# Altium project HLib-MBoard1.PrjPCB
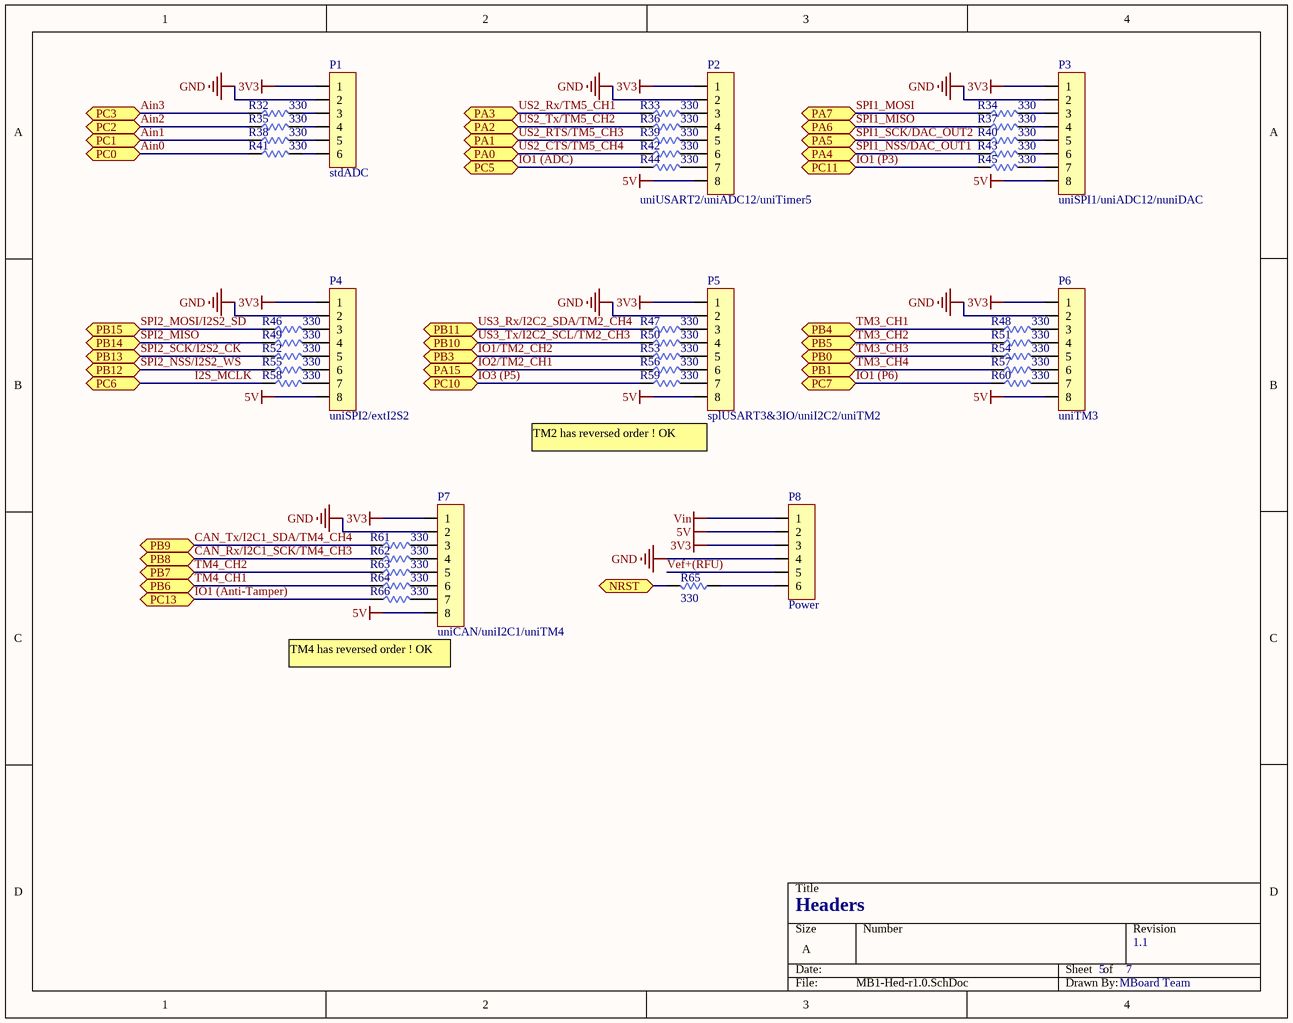
[diagram p0: MB1-Hed-r1.0.SchDoc]
6 sheets, 134 parts. Net scope: hierarchical (ports join the sheet entries above them; power ports are global).
Board file: HLib-MBoard1.PcbDoc
Sheets:
  MB1-Hed-r1.0.SchDoc
  MB1-MCU-r1.0.SchDoc
  MB1-USB-r1.0.SchDoc
  MB1-SD_CARD.SchDoc
  MB1-LED_BUTTON.SchDoc
  MB1-Pwr-r1.0.SchDoc

## Sheet MB1-Hed-r1.0.SchDoc: Headers
size A; DrawnBy: MBoard Team; DocumentNumber: 5; Revision: 1.1; SheetNumber: 5; SheetTotal: 7

### Parts
P1  stdADC  [Hed6]
P2  uniUSART2/uniADC12/uniTimer5  [Hed8]
P3  uniSPI1/uniADC12/nuniDAC  [Hed8]
P4  uniSPI2/extI2S2  [Hed8]
P5  splUSART3&3IO/uniI2C2/uniTM2  [Hed8]
P6  uniTM3  [Hed8]
P7  uniCAN/uniI2C1/uniTM4  [Hed8]
P8  Power  [Hed6]
R32  value 330  [SM_0805_R]  (hidden comment: R)
R33  value 330  [SM_0805_R]  (hidden comment: R)
R34  value 330  [SM_0805_R]  (hidden comment: R)
R35  value 330  [SM_0805_R]  (hidden comment: R)
R36  value 330  [SM_0805_R]  (hidden comment: R)
R37  value 330  [SM_0805_R]  (hidden comment: R)
R38  value 330  [SM_0805_R]  (hidden comment: R)
R39  value 330  [SM_0805_R]  (hidden comment: R)
R40  value 330  [SM_0805_R]  (hidden comment: R)
R41  value 330  [SM_0805_R]  (hidden comment: R)
R42  value 330  [SM_0805_R]  (hidden comment: R)
R43  value 330  [SM_0805_R]  (hidden comment: R)
R44  value 330  [SM_0805_R]  (hidden comment: R)
R45  value 330  [SM_0805_R]  (hidden comment: R)
R46  value 330  [SM_0805_R]  (hidden comment: R)
R47  value 330  [SM_0805_R]  (hidden comment: R)
R48  value 330  [SM_0805_R]  (hidden comment: R)
R49  value 330  [SM_0805_R]  (hidden comment: R)
R50  value 330  [SM_0805_R]  (hidden comment: R)
R51  value 330  [SM_0805_R]  (hidden comment: R)
R52  value 330  [SM_0805_R]  (hidden comment: R)
R53  value 330  [SM_0805_R]  (hidden comment: R)
R54  value 330  [SM_0805_R]  (hidden comment: R)
R55  value 330  [SM_0805_R]  (hidden comment: R)
R56  value 330  [SM_0805_R]  (hidden comment: R)
R57  value 330  [SM_0805_R]  (hidden comment: R)
R58  value 330  [SM_0805_R]  (hidden comment: R)
R59  value 330  [SM_0805_R]  (hidden comment: R)
R60  value 330  [SM_0805_R]  (hidden comment: R)
R61  value 330  [SM_0805_R]  (hidden comment: R)
R62  value 330  [SM_0805_R]  (hidden comment: R)
R63  value 330  [SM_0805_R]  (hidden comment: R)
R64  value 330  [SM_0805_R]  (hidden comment: R)
R65  value 330  [SM_0805_R]  (hidden comment: R)
R66  value 330  [SM_0805_R]  (hidden comment: R)

### Ports
NRST (bidir), PA0 (bidir), PA1 (bidir), PA2 (bidir), PA3 (bidir), PA4 (bidir), PA5 (bidir), PA6 (bidir), PA7 (bidir), PA15 (bidir), PB0 (bidir), PB1 (bidir), PB3 (bidir), PB4 (bidir), PB5 (bidir), PB6 (bidir), PB7 (bidir), PB8 (bidir), PB9 (bidir), PB10 (bidir), PB11 (bidir), PB12 (bidir), PB13 (bidir), PB14 (bidir), PB15 (bidir), PC0 (bidir), PC1 (bidir), PC2 (bidir), PC3 (bidir), PC5 (bidir), PC6 (bidir), PC7 (bidir), PC10 (bidir), PC11 (bidir), PC13 (bidir)

### Nets
3V3: P1.1 P2.1 P3.1 P4.1 P5.1 P6.1 P7.1 P8.3
5V: P2.8 P3.8 P4.8 P5.8 P6.8 P7.8 P8.2
GND: P1.2 P2.2 P3.2 P4.2 P5.2 P6.2 P7.2 P8.4
Vin: P8.1
Ain0: R41.1 ; port PC0
Ain1: R38.1 ; port PC1
Ain2: R35.1 ; port PC2
Ain3: R32.1 ; port PC3
CAN_Rx/I2C1_SCK/TM4_CH3: R62.1 ; port PB8
CAN_Tx/I2C1_SDA/TM4_CH4: R61.1 ; port PB9
I2S_MCLK: R58.1 ; port PC6
IO1 (ADC): R44.1 ; port PC5
IO1 (Anti-Tamper): R66.1 ; port PC13
IO1 (P3): R45.1 ; port PC11
IO1 (P6): R60.1 ; port PC7
IO1/TM2_CH2: R53.1 ; port PB3
IO2/TM2_CH1: R56.1 ; port PA15
IO3 (P5): R59.1 ; port PC10
SPI1_MISO: R37.1 ; port PA6
SPI1_MOSI: R34.1 ; port PA7
SPI1_NSS/DAC_OUT1: R43.1 ; port PA4
SPI1_SCK/DAC_OUT2: R40.1 ; port PA5
SPI2_MISO: R49.1 ; port PB14
SPI2_MOSI/I2S2_SD: R46.1 ; port PB15
SPI2_NSS/I2S2_WS: R55.1 ; port PB12
SPI2_SCK/I2S2_CK: R52.1 ; port PB13
TM3_CH1: R48.1 ; port PB4
TM3_CH2: R51.1 ; port PB5
TM3_CH3: R54.1 ; port PB0
TM3_CH4: R57.1 ; port PB1
TM4_CH1: R64.1 ; port PB6
TM4_CH2: R63.1 ; port PB7
US2_CTS/TM5_CH4: R42.1 ; port PA0
US2_RTS/TM5_CH3: R39.1 ; port PA1
US2_Rx/TM5_CH1: R33.1 ; port PA3
US2_Tx/TM5_CH2: R36.1 ; port PA2
US3_Rx/I2C2_SDA/TM2_CH4: R47.1 ; port PB11
US3_Tx/I2C2_SCL/TM2_CH3: R50.1 ; port PB10
Vef+(RFU): P8.5
NetP1_3: P1.3 R32.2
NetP1_4: P1.4 R35.2
NetP1_5: P1.5 R38.2
NetP1_6: P1.6 R41.2
NetP2_3: P2.3 R33.2
NetP2_4: P2.4 R36.2
NetP2_5: P2.5 R39.2
NetP2_6: P2.6 R42.2
NetP2_7: P2.7 R44.2
NetP3_3: P3.3 R34.2
NetP3_4: P3.4 R37.2
NetP3_5: P3.5 R40.2
NetP3_6: P3.6 R43.2
NetP3_7: P3.7 R45.2
NetP4_3: P4.3 R46.2
NetP4_4: P4.4 R49.2
NetP4_5: P4.5 R52.2
NetP4_6: P4.6 R55.2
NetP4_7: P4.7 R58.2
NetP5_3: P5.3 R47.2
NetP5_4: P5.4 R50.2
NetP5_5: P5.5 R53.2
NetP5_6: P5.6 R56.2
NetP5_7: P5.7 R59.2
NetP6_3: P6.3 R48.2
NetP6_4: P6.4 R51.2
NetP6_5: P6.5 R54.2
NetP6_6: P6.6 R57.2
NetP6_7: P6.7 R60.2
NetP7_3: P7.3 R61.2
NetP7_4: P7.4 R62.2
NetP7_5: P7.5 R63.2
NetP7_6: P7.6 R64.2
NetP7_7: P7.7 R66.2
NetP8_6: P8.6 R65.2
NetR65_1: R65.1 ; port NRST

### Notes on the sheet
- TM2 has reversed order ! OK
- TM4 has reversed order ! OK

### Library data of the parts
P1 P8 = Hed6
P2-P7 = Hed8
R32-R66 = R: Resistor; Published: 8-Jun-2000; LatestRevisionDate: 29-May-2009; LatestRevisionNote: IPC-7351 Footprint Added.; PackageReference: J1-0603; Publisher: Altium Limited; PackageDescription: Chip Resistor

## Sheet MB1-MCU-r1.0.SchDoc: STM32F103
size A; DrawnBy: MBoard team; DocumentNumber: 2; Revision: 1.1; SheetNumber: 2; SheetTotal: 7
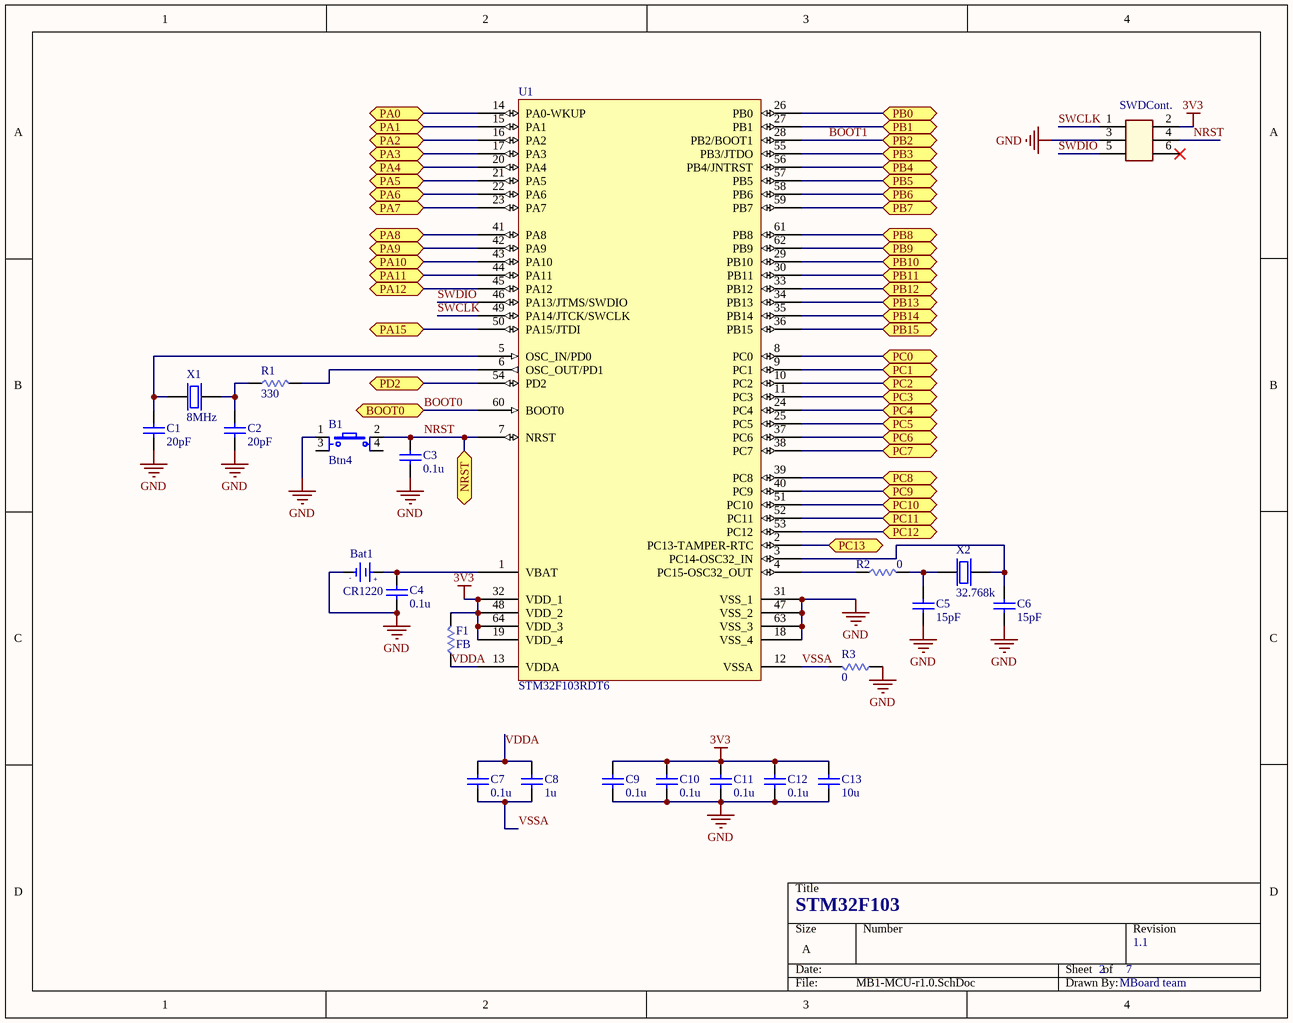
[diagram p1: MB1-MCU-r1.0.SchDoc]

### Parts
B1  Btn4  [Horizon_SW_4pin_rectangular]
Bat1  value CR1220  [PIN3VSOCKET-SMD]  (hidden comment: PIN 3V)
C1  value 20pF  [SM_0805_C_CERAMIC]  (hidden comment: CAP Ceramic)
C2  value 20pF  [SM_0805_C_CERAMIC]  (hidden comment: CAP Ceramic)
C3  value 0.1u  [SM_0805_C_CERAMIC]  (hidden comment: CAP Ceramic)
C4  value 0.1u  [SM_0805_C_CERAMIC]  (hidden comment: CAP Ceramic)
C5  value 15pF  [SM_0805_C_CERAMIC]  (hidden comment: CAP Ceramic)
C6  value 15pF  [SM_0805_C_CERAMIC]  (hidden comment: CAP Ceramic)
C7  value 0.1u  [SM_0805_C_CERAMIC]  (hidden comment: CAP Ceramic)
C8  value 1u  [SM_0805_C_CERAMIC]  (hidden comment: CAP Ceramic)
C9  value 0.1u  [SM_0805_C_CERAMIC]  (hidden comment: CAP Ceramic)
C10  value 0.1u  [SM_0805_C_CERAMIC]  (hidden comment: CAP Ceramic)
C11  value 0.1u  [SM_0805_C_CERAMIC]  (hidden comment: CAP Ceramic)
C12  value 0.1u  [SM_0805_C_CERAMIC]  (hidden comment: CAP Ceramic)
C13  value 10u  [SM_0805_C_CERAMIC]  (hidden comment: CAP Ceramic)
F1  value FB  [SM_0805_R]  (hidden comment: Ferrite bead)
R1  value 330  [SM_0805_R]
R2  value 0  [SM_0805_R]
R3  value 0  [SM_0805_R]
SWDCont.  SWD  [Hed3x2-RA]  (value not drawn)
U1  STM32F103RDT6  [LQFP64_L]
X1  value 8MHz  [HC49/US-SMD]  (hidden comment: Crystal 2 pin.)
X2  value 32.768k  [XT32-LOB]  (hidden comment: Crystal 32.768 k)

### Ports
BOOT0 (bidir), NRST (bidir), PA0 (bidir), PA1 (bidir), PA2 (bidir), PA3 (bidir), PA4 (bidir), PA5 (bidir), PA6 (bidir), PA7 (bidir), PA8 (bidir), PA9 (bidir), PA10 (bidir), PA11 (bidir), PA12 (bidir), PA15 (bidir), PB0 (bidir), PB1 (bidir), PB2 (bidir), PB3 (bidir), PB4 (bidir), PB5 (bidir), PB6 (bidir), PB7 (bidir), PB8 (bidir), PB9 (bidir), PB10 (bidir), PB11 (bidir), PB12 (bidir), PB13 (bidir), PB14 (bidir), PB15 (bidir), PC0 (bidir), PC1 (bidir), PC2 (bidir), PC3 (bidir), PC4 (bidir), PC5 (bidir), PC6 (bidir), PC7 (bidir), PC8 (bidir), PC9 (bidir), PC10 (bidir), PC11 (bidir), PC12 (bidir), PC13 (bidir), PD2 (bidir)

### Nets
3V3: C9.2 C10.2 C11.2 C12.2 C13.2 F1.2 SWDCont..2 U1.19(VDD_4) U1.32(VDD_1) U1.48(VDD_2) U1.64(VDD_3)
GND: B1.1(Tab) Bat1.2(GND) C1.1 C2.1 C3.1 C4.1 C5.1 C6.1 C9.1 C10.1 C11.1 C12.1 C13.1 R3.1 SWDCont..3 U1.18(VSS_4) U1.31(VSS_1) U1.47(VSS_2) U1.63(VSS_3)
BOOT0: U1.60(BOOT0) ; port BOOT0
BOOT1: U1.28(PB2/BOOT1) ; port PB2
NRST: B1.2(Tab) C3.2 SWDCont..4 U1.7(NRST) ; port NRST
SWCLK: SWDCont..1 U1.49(PA14/JTCK/SWCLK)
SWDIO: SWDCont..5 U1.46(PA13/JTMS/SWDIO)
VDDA: C7.2 C8.2 F1.1 U1.13(VDDA)
VSSA: C7.1 C8.1 R3.2 U1.12(VSSA)
NetBat1_1: Bat1.1(+3V) C4.2 U1.1(VBAT)
NetC1_2: C1.2 U1.5(OSC_IN/PD0) X1.1(Xin)
NetC2_2: C2.2 R1.1 X1.2(Xout)
NetC5_2: C5.2 R2.2 X2.1(Xin)
NetC6_2: C6.2 U1.3(PC14-OSC32_IN) X2.2(Xout)
NetR1_2: R1.2 U1.6(OSC_OUT/PD1)
NetR2_1: R2.1 U1.4(PC15-OSC32_OUT)
NetU1_2: U1.2(PC13-TAMPER-RTC) ; port PC13
NetU1_8: U1.8(PC0) ; port PC0
NetU1_9: U1.9(PC1) ; port PC1
NetU1_10: U1.10(PC2) ; port PC2
NetU1_11: U1.11(PC3) ; port PC3
NetU1_14: U1.14(PA0-WKUP) ; port PA0
NetU1_15: U1.15(PA1) ; port PA1
NetU1_16: U1.16(PA2) ; port PA2
NetU1_17: U1.17(PA3) ; port PA3
NetU1_20: U1.20(PA4) ; port PA4
NetU1_21: U1.21(PA5) ; port PA5
NetU1_22: U1.22(PA6) ; port PA6
NetU1_23: U1.23(PA7) ; port PA7
NetU1_24: U1.24(PC4) ; port PC4
NetU1_25: U1.25(PC5) ; port PC5
NetU1_26: U1.26(PB0) ; port PB0
NetU1_27: U1.27(PB1) ; port PB1
NetU1_29: U1.29(PB10) ; port PB10
NetU1_30: U1.30(PB11) ; port PB11
NetU1_33: U1.33(PB12) ; port PB12
NetU1_34: U1.34(PB13) ; port PB13
NetU1_35: U1.35(PB14) ; port PB14
NetU1_36: U1.36(PB15) ; port PB15
NetU1_37: U1.37(PC6) ; port PC6
NetU1_38: U1.38(PC7) ; port PC7
NetU1_39: U1.39(PC8) ; port PC8
NetU1_40: U1.40(PC9) ; port PC9
NetU1_41: U1.41(PA8) ; port PA8
NetU1_42: U1.42(PA9) ; port PA9
NetU1_43: U1.43(PA10) ; port PA10
NetU1_44: U1.44(PA11) ; port PA11
NetU1_45: U1.45(PA12) ; port PA12
NetU1_50: U1.50(PA15/JTDI) ; port PA15
NetU1_51: U1.51(PC10) ; port PC10
NetU1_52: U1.52(PC11) ; port PC11
NetU1_53: U1.53(PC12) ; port PC12
NetU1_54: U1.54(PD2) ; port PD2
NetU1_55: U1.55(PB3/JTDO) ; port PB3
NetU1_56: U1.56(PB4/JNTRST) ; port PB4
NetU1_57: U1.57(PB5) ; port PB5
NetU1_58: U1.58(PB6) ; port PB6
NetU1_59: U1.59(PB7) ; port PB7
NetU1_61: U1.61(PB8) ; port PB8
NetU1_62: U1.62(PB9) ; port PB9

Not connected (* = marked no-connect by the designer): B1 3(Tab) 4(Tab); SWDCont. 6*

### Notes on the sheet
- (in symbol PIN 3V) -; +

### Library data of the parts
Bat1 = PIN 3V: Battery 3VDC
C1-C13 = CAP Ceramic: Non-polarity ceramic capacitor; Published: 8-Jun-2000; LatestRevisionDate: 17-Jul-2002; LatestRevisionNote: Re-released for DXP Platform.; PackageReference: RAD-0.3; Publisher: Altium Limited; PackageDescription: Radial Cap, Thru-Hole; 2 Leads; 0.3 in Pin Spacing
F1 R1-R3 = R: Resistor; Published: 8-Jun-2000; LatestRevisionDate: 29-May-2009; LatestRevisionNote: IPC-7351 Footprint Added.; PackageReference: J1-0603; Publisher: Altium Limited; PackageDescription: Chip Resistor
SWDCont. = HD_3x2: Header, 3-pins/row, double row,
U1 = STM32F103RBT6: STM32 ARM-based 32-bit MCU with 128 Kbytes Flash, 64-pin LQFP, Industrial Temperature; Published: 30-May-2008; DatasheetVersion: rev6, Mar-2008; PackageVersion: Mar-2008; PackageReference: LQFP64; Publisher: Altium Limited; PackageDescription: 64-Pin Low-Profile Quad Flat Pack, 10 x 10 mm Body, 0.5 mm Pitch (LQFP64); ComponentLink1Description: Manufacturer Link; ComponentLink1URL: www.st.com/stm32; ComponentLink2Description: Datasheet; ComponentLink2URL: http://www.st.com/stonline/products/literature/ds/13587.pdf
X1 = XT2
X2 = XT32k

## Sheet MB1-USB-r1.0.SchDoc: USB2Com & USB Native
size A; DrawnBy: MBoard team; DocumentNumber: 3; Revision: 1.1; SheetNumber: 3; SheetTotal: 7
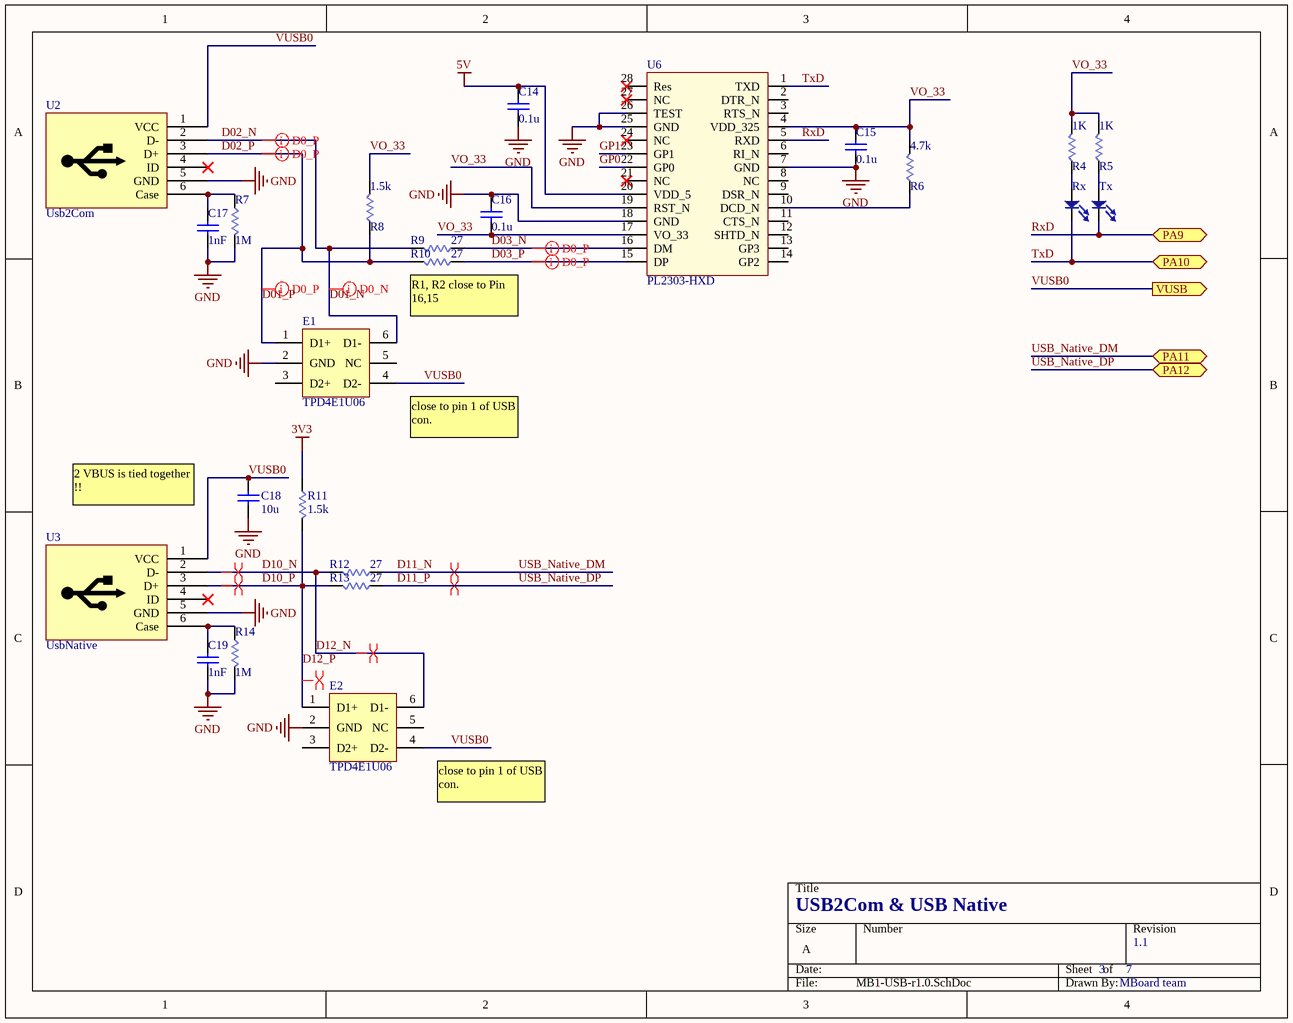
[diagram p2: MB1-USB-r1.0.SchDoc]

### Parts
C14  value 0.1u  [SM_0805_C_CERAMIC]  (hidden comment: CAP Ceramic)
C15  value 0.1u  [SM_0805_C_CERAMIC]  (hidden comment: CAP Ceramic)
C16  value 0.1u  [SM_0805_C_CERAMIC]  (hidden comment: CAP Ceramic)
C17  value 1nF  [SM_0805_C_CERAMIC]  (hidden comment: CAP Ceramic)
C18  value 10u  [SM_0805_C_CERAMIC]  (hidden comment: CAP Ceramic)
C19  value 1nF  [SM_0805_C_CERAMIC]  (hidden comment: CAP Ceramic)
E1  TPD4E1U06  [SC70-6]
E2  TPD4E1U06  [SC70-6]
R4  value 1K  [SM_0805_R]
R5  value 1K  [SM_0805_R]
R6  value 4.7k  [SM_0805_R]
R7  value 1M  [SM_0805_R]
R8  value 1.5k  [SM_0805_R]
R9  value 27  [SM_0805_R]
R10  value 27  [SM_0805_R]
R11  value 1.5k  [SM_0805_R]
R12  value 27  [SM_0805_R]
R13  value 27  [SM_0805_R]
R14  value 1M  [SM_0805_R]
Rx  Blue  [SM_0805_POL_LD]  (value not drawn)
Tx  Green  [SM_0805_POL_LD]  (value not drawn)
U2  Usb2Com  [USB_Micro_typeB_2]
U3  UsbNative  [USB_Micro_typeB_2]
U6  PL2303-HXD  [SSOP-28]

### Ports
PA9 (bidir), PA10 (bidir), PA11 (bidir), PA12 (bidir), VUSB (out)

### Nets
3V3: R11.1
5V: C14.2 U6.20(VDD_5)
GND: C14.1 C15.1 C16.2 C17.1 C18.1 C19.1 E1.2(GND) E2.2(GND) R7.2 R14.2 U2.5(GND) U3.5(GND) U6.7(GND) U6.18(GND) U6.25(GND) U6.26(TEST)
D01_N: E1.6(D1-) R9.2 U2.2(D-)  [also labelled D02_N]
D01_P: E1.1(D1+) R8.1 R10.2 U2.3(D+)  [also labelled D02_P]
D03_N: R9.1 U6.16(DM)
D03_P: R10.1 U6.15(DP)
D10_N: E2.6(D1-) R12.2 U3.2(D-)  [also labelled D12_N]
D10_P: E2.1(D1+) R11.2 R13.2 U3.3(D+)  [also labelled D12_P]
D11_N: R12.1 ; port PA11  [also labelled USB_Native_DM]
D11_P: R13.1 ; port PA12  [also labelled USB_Native_DP]
GP0: U6.22(GP0)
GP1: U6.23(GP1)
RxD: Tx.2(K) U6.5(RXD) ; port PA9
TxD: Rx.2(K) U6.1(TXD) ; port PA10
VO_33: C15.2 C16.1 R4.2 R5.2 R6.2 R8.2 U6.4(VDD_325) U6.17(VO_33) U6.19(RST_N)
VUSB0: C18.2 E1.4(D2-) E2.4(D2-) U2.1(VCC) U3.1(VCC) ; port VUSB
NetC17_2: C17.2 R7.1 U2.6(Case)
NetC19_2: C19.2 R14.1 U3.6(Case)
NetR4_1: R4.1 Rx.1(A)
NetR5_1: R5.1 Tx.1(A)
NetR6_1: R6.1 U6.10(DCD_N)

Not connected (* = marked no-connect by the designer): E1 3(D2+) 5(NC); E2 3(D2+) 5(NC); U2 4(ID)*; U3 4(ID)*; U6 2(DTR_N) 3(RTS_N) 6(RI_N) 8(NC) 9(DSR_N) 11(CTS_N) 12(SHTD_N) 13(GP3) 14(GP2) 21(NC)* 24(NC)* 27(NC)* 28(Res)*

### Layout directives
differential pair: D01_N, D01_P, D03_N, D03_P, D10_N, D10_P, D11_N, D11_P

### Notes on the sheet
- (near R10) R1, R2 close to Pin 16,15
- (near E1) close to pin 1 of USB con.
- 2 VBUS is tied together !!
- (near E2) close to pin 1 of USB con.

### Library data of the parts
C14-C19 = CAP Ceramic: Non-polarity ceramic capacitor; Published: 8-Jun-2000; LatestRevisionDate: 17-Jul-2002; LatestRevisionNote: Re-released for DXP Platform.; PackageReference: RAD-0.3; Publisher: Altium Limited; PackageDescription: Radial Cap, Thru-Hole; 2 Leads; 0.3 in Pin Spacing
R4-R14 = R: Resistor; Published: 8-Jun-2000; LatestRevisionDate: 29-May-2009; LatestRevisionNote: IPC-7351 Footprint Added.; PackageReference: J1-0603; Publisher: Altium Limited; PackageDescription: Chip Resistor
Rx Tx = LED: Published: 8-Jun-2000; LatestRevisionDate: 08-Jul-2005; LatestRevisionNote: Mech Layer 1 removed.; PackageReference: LED-1; Publisher: Altium Limited; PackageDescription: LED; 2 Leads
U2 U3 = USB-Mini-B

## Sheet MB1-SD_CARD.SchDoc: uSD card
size A; Author: Nguyen Van Hien; DrawnBy: MBoard team; DocumentNumber: 6; Revision: 1.1; SheetNumber: 6; SheetTotal: 7; DocumentName: SD_CARD
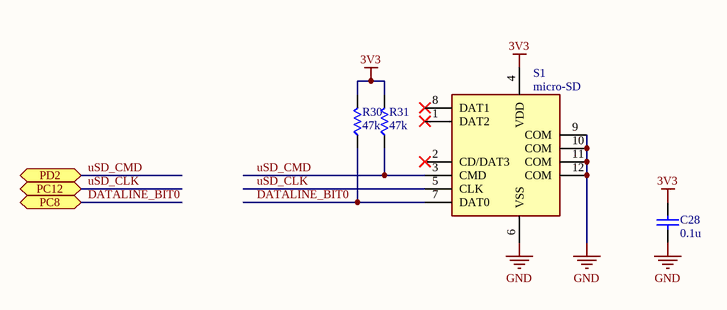
[diagram p3: MB1-SD_CARD.SchDoc]

### Parts
C28  value 0.1u  [SM_0805_C_CERAMIC]  (hidden comment: CAP_Ceramic)
R30  value 47k  [SM_0805_R]
R31  value 47k  [SM_0805_R]
S1  micro-SD  [micro-SD]

### Ports
PC8 (bidir), PC12 (bidir), PD2 (bidir)

### Nets
3V3: C28.2 R30.2 R31.2 S1.4(VDD)
GND: C28.1 S1.6(VSS) S1.9(COM) S1.10(COM) S1.11(COM) S1.12(COM)
DATALINE_BIT0: R30.1 S1.7(DAT0) ; port PC8
uSD_CLK: S1.5(CLK) ; port PC12
uSD_CMD: R31.1 S1.3(CMD) ; port PD2

Not connected (* = marked no-connect by the designer): S1 1(DAT2)* 2(CD/DAT3)* 8(DAT1)*

### Library data of the parts
C28 = C_Ceramic: Non-polarity ceramic capacitor; Published: 8-Jun-2000; LatestRevisionDate: 17-Jul-2002; LatestRevisionNote: Re-released for DXP Platform.; PackageReference: RAD-0.3; Publisher: Altium Limited; PackageDescription: Radial Cap, Thru-Hole; 2 Leads; 0.3 in Pin Spacing
R30 R31 = R: Resistor; Published: 8-Jun-2000; LatestRevisionDate: 29-May-2009; LatestRevisionNote: IPC-7351 Footprint Added.; PackageReference: J1-0603; Publisher: Altium Limited; PackageDescription: Chip Resistor

## Sheet MB1-LED_BUTTON.SchDoc: Leds & Buttons
size A; Author: Nguyen Van Hien; DrawnBy: MBoard team; DocumentNumber: 7; Revision: 1.1; SheetNumber: 7; SheetTotal: 7; DocumentName: LED_BUTTON
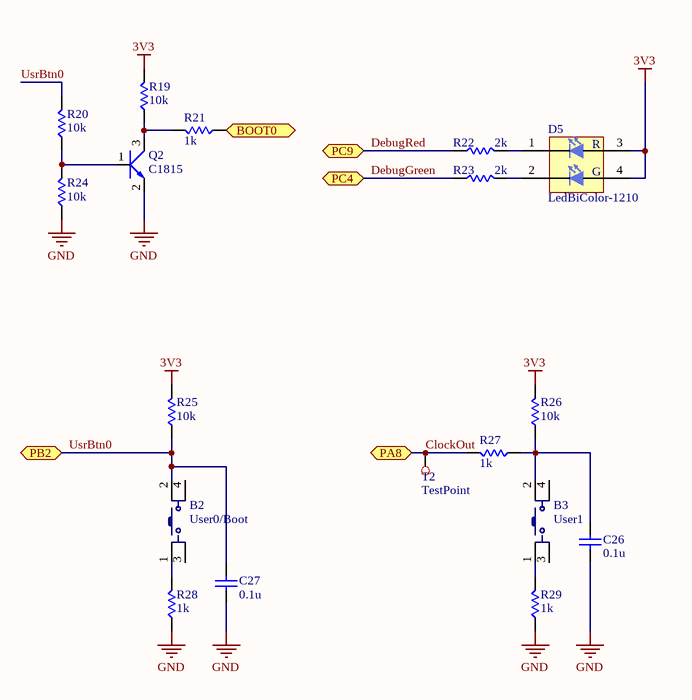
[diagram p4: MB1-LED_BUTTON.SchDoc]

### Parts
B2  User0/Boot  [Horizon_SW_4pin_rectangular]
B3  User1  [Horizon_SW_4pin_rectangular]
C26  value 0.1u  [SM_0805_C_CERAMIC]  (hidden comment: CAP_Ceramic)
C27  value 0.1u  [SM_0805_C_CERAMIC]  (hidden comment: CAP_Ceramic)
D5  LedBiColor-1210  [Led-BiColor]
Q2  C1815  [SOT23]
R19  value 10k  [SM_0805_R]
R20  value 10k  [SM_0805_R]
R21  value 1k  [SM_0805_R]
R22  value 2k  [SM_0805_R]
R23  value 2k  [SM_0805_R]
R24  value 10k  [SM_0805_R]
R25  value 10k  [SM_0805_R]
R26  value 10k  [SM_0805_R]
R27  value 1k  [SM_0805_R]
R28  value 1k  [SM_0805_R]
R29  value 1k  [SM_0805_R]
T2  TestPoint  [TestPoint]

### Ports
BOOT0 (bidir), PA8 (bidir), PB2 (bidir), PC4 (bidir), PC9 (bidir)

### Nets
3V3: D5.3(R+) D5.4(G+) R19.2 R25.2 R26.2
GND: C26.1 C27.1 Q2.2(E) R24.1 R28.1 R29.1
ClockOut: R27.2 T2.1 ; port PA8
DebugGreen: R23.1 ; port PC4
DebugRed: R22.1 ; port PC9
UsrBtn0: B2.2 C27.2 R20.2 R25.1 ; port PB2
NetB2_1: B2.1 R28.2
NetB3_1: B3.1 R29.2
NetB3_2: B3.2 C26.2 R26.1 R27.1
NetD5_1: D5.1(R-) R22.2
NetD5_2: D5.2(G-) R23.2
NetQ2_1: Q2.1(B) R20.1 R24.2
NetQ2_3: Q2.3(C) R19.1 R21.2
NetR21_1: R21.1 ; port BOOT0

Not connected (* = marked no-connect by the designer): B2 3 4; B3 3 4

### Notes on the sheet
- (in symbol LedBiColor-1210) R; G

### Library data of the parts
B2 B3 = Button: Tact switch
C26 C27 = C_Ceramic: Non-polarity ceramic capacitor; Published: 8-Jun-2000; LatestRevisionDate: 17-Jul-2002; LatestRevisionNote: Re-released for DXP Platform.; PackageReference: RAD-0.3; Publisher: Altium Limited; PackageDescription: Radial Cap, Thru-Hole; 2 Leads; 0.3 in Pin Spacing
R19-R29 = R: Resistor; Published: 8-Jun-2000; LatestRevisionDate: 29-May-2009; LatestRevisionNote: IPC-7351 Footprint Added.; PackageReference: J1-0603; Publisher: Altium Limited; PackageDescription: Chip Resistor

## Sheet MB1-Pwr-r1.0.SchDoc: Power
size A; DrawnBy: MBoard team; DocumentNumber: 4; Revision: 1.1; SheetNumber: 4; SheetTotal: 7
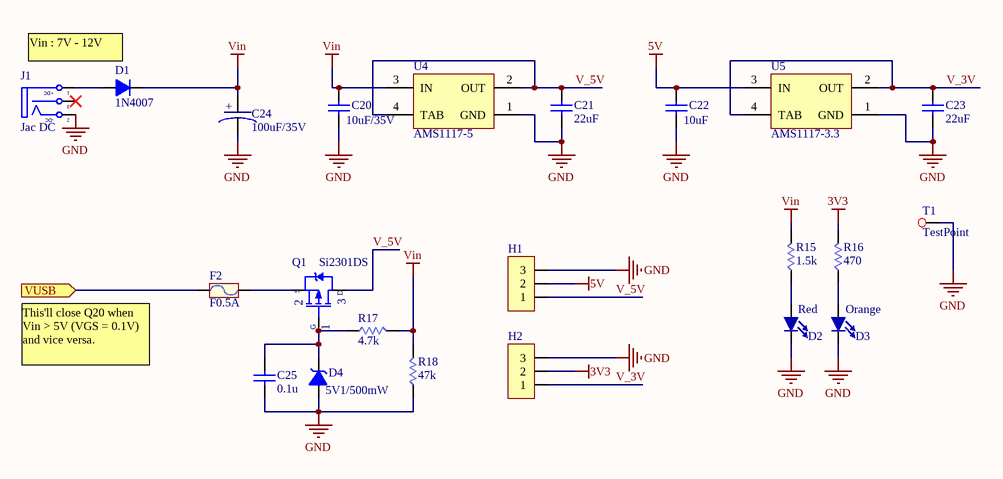
[diagram p5: MB1-Pwr-r1.0.SchDoc]

### Parts
C20  value 10uF/35V  [SM-1210]  (hidden comment: CAP Ceramic)
C21  value 22uF  [SM_0805_C_CERAMIC]  (hidden comment: CAP Ceramic)
C22  value 10uF  [SM_0805_C_CERAMIC]  (hidden comment: CAP Ceramic)
C23  value 22uF  [SM_0805_C_CERAMIC]  (hidden comment: CAP Ceramic)
C24  value 100uF/35V  [Cap-Alu-D8]  (hidden comment: CapT)
C25  value 0.1u  [SM_0805_C_CERAMIC]  (hidden comment: CAP Ceramic)
D1  1N4007  [DO-214AC]
D2  Red  [SM_0805_POL_LD]
D3  Orange  [SM_0805_POL_LD]
D4  5V1/500mW  [SOD-123]
F2  F0.5A  [SMD-1812]
H1  Hed3  [Hed3]  (value not drawn)
H2  Hed3  [Hed3]  (value not drawn)
J1  Jac DC  [DCJack]
Q1  Si2301DS  [SOT23]
R15  value 1.5k  [SM_0805_R]
R16  value 470  [SM_0805_R]
R17  value 4.7k  [SM_0805_R]
R18  value 47k  [SM_0805_R]
T1  TestPoint  [TestPoint]
U4  AMS1117-5  [MP04A_N]
U5  AMS1117-3.3  [MP04A_N]

### Ports
VUSB (in)

### Nets
3V3: H2.2 R16.2
5V: C22.2 H1.2 U5.3(IN)
GND: C20.1 C21.1 C22.1 C23.1 C24.2(-) C25.1 D2.2(K) D3.2(K) D4.1(A) H1.3 H2.3 J1.2(TN) R18.1 T1.1 U4.1(GND) U5.1(GND)
Vin: C20.2 C24.1(+) D1.2(K) R15.2 R17.2 R18.2 U4.3(IN)
V_3V: C23.2 H2.1 U5.2(OUT) U5.4(TAB)
V_5V: C21.2 H1.1 Q1.3(D) U4.2(OUT) U4.4(TAB)
NetC25_2: C25.2 D4.2(K) Q1.1(G) R17.1
NetD1_1: D1.1(A) J1.1(T)
NetD2_1: D2.1(A) R15.1
NetD3_1: D3.1(A) R16.1
NetF2_1: F2.1 ; port VUSB
NetF2_2: F2.2 Q1.2(S)

Not connected (* = marked no-connect by the designer): J1 3(S)*

### Notes on the sheet
- Vin : 7V - 12V
- This'll close Q20 when Vin > 5V (VGS = 0.1V) and vice versa.
- (in symbol DCIN) +DC; -DC

### Library data of the parts
C20-C23 C25 = CAP Ceramic: Non-polarity ceramic capacitor; Published: 8-Jun-2000; LatestRevisionDate: 17-Jul-2002; LatestRevisionNote: Re-released for DXP Platform.; PackageReference: RAD-0.3; Publisher: Altium Limited; PackageDescription: Radial Cap, Thru-Hole; 2 Leads; 0.3 in Pin Spacing
C24 = CapA
D1 = D1A: Diode 1A; Value: 1N4007
D2 D3 = LED: Published: 8-Jun-2000; LatestRevisionDate: 08-Jul-2005; LatestRevisionNote: Mech Layer 1 removed.; PackageReference: LED-1; Publisher: Altium Limited; PackageDescription: LED; 2 Leads
D4 = DZ: Diode Zenner; Value: 5V1/500mW
F2 = Fuse: Designed by: VanDungEvn; Value: Fuse
J1 = DCIN: Jac DC input; Value: Jac DC
Q1 = P-MOSFET: P-Channel 1.25-W, 2.5-V MOSFET
R15-R18 = R: Resistor; Published: 8-Jun-2000; LatestRevisionDate: 29-May-2009; LatestRevisionNote: IPC-7351 Footprint Added.; PackageReference: J1-0603; Publisher: Altium Limited; PackageDescription: Chip Resistor
U4 U5 = LM1117IMP-3.3: 800mA Low-Dropout Linear Regulator, 4-pin SOT-223; Manufacturer: National Semiconductor; PackageTopMarking: XYTT*N05B; PowerWise: N; CompType: LDO IC; Published: 4-Dec-2008; DatasheetVersion: Apr-2006; PackageVersion: revB, Apr-2003; PackageReference: MP04A; Publisher: Altium Limited; PackageDescription: Molded SOT-223, 6.50 x 3.56 x 1.6mm Body, 4 Lead, 2.3mm Pitch; Supplier 1: Farnell; Supplier Part Number 1: 7614123; PartNumber: LM1117IMP-3.3; RoHS: N; PinCount: 4; Code_JEDEC: TO-261-AA; Code_IPC: SOT223-4; ComponentLink1Description: LM1117 Datasheet; ComponentLink1URL: http://www.national.com/ds/LM/LM1117.pdf; ComponentLink2Description: LM1117 Web Page; ComponentLink2URL: http://www.national.com/pf/LM/LM1117.html; ComponentLink3Description: MP04A Package Page; ComponentLink3URL: http://www.national.com/packaging/folders/mp04a.html

## Nets that join several sheets
3V3: MB1-Hed-r1.0 (8 pins), MB1-MCU-r1.0 (11 pins), MB1-USB-r1.0 (R11.1), MB1-SD_CARD (C28.2 R30.2 R31.2 S1.4), MB1-LED_BUTTON (5 pins), MB1-Pwr-r1.0 (H2.2 R16.2)
5V: MB1-Hed-r1.0 (7 pins), MB1-USB-r1.0 (C14.2 U6.20), MB1-Pwr-r1.0 (C22.2 H1.2 U5.3)
GND: MB1-Hed-r1.0 (8 pins), MB1-MCU-r1.0 (19 pins), MB1-USB-r1.0 (16 pins), MB1-SD_CARD (6 pins), MB1-LED_BUTTON (6 pins), MB1-Pwr-r1.0 (16 pins)
Vin: MB1-Hed-r1.0 (P8.1), MB1-Pwr-r1.0 (7 pins)